# Altium schematic sheet LPDDR4.SchDoc: LPDDR4
size A2; DrawnBy: UKAYACIK; Engineer: UKAYACIK; DocumentNumber: 10; Revision: B; SheetNumber: 12; SheetTotal: 21
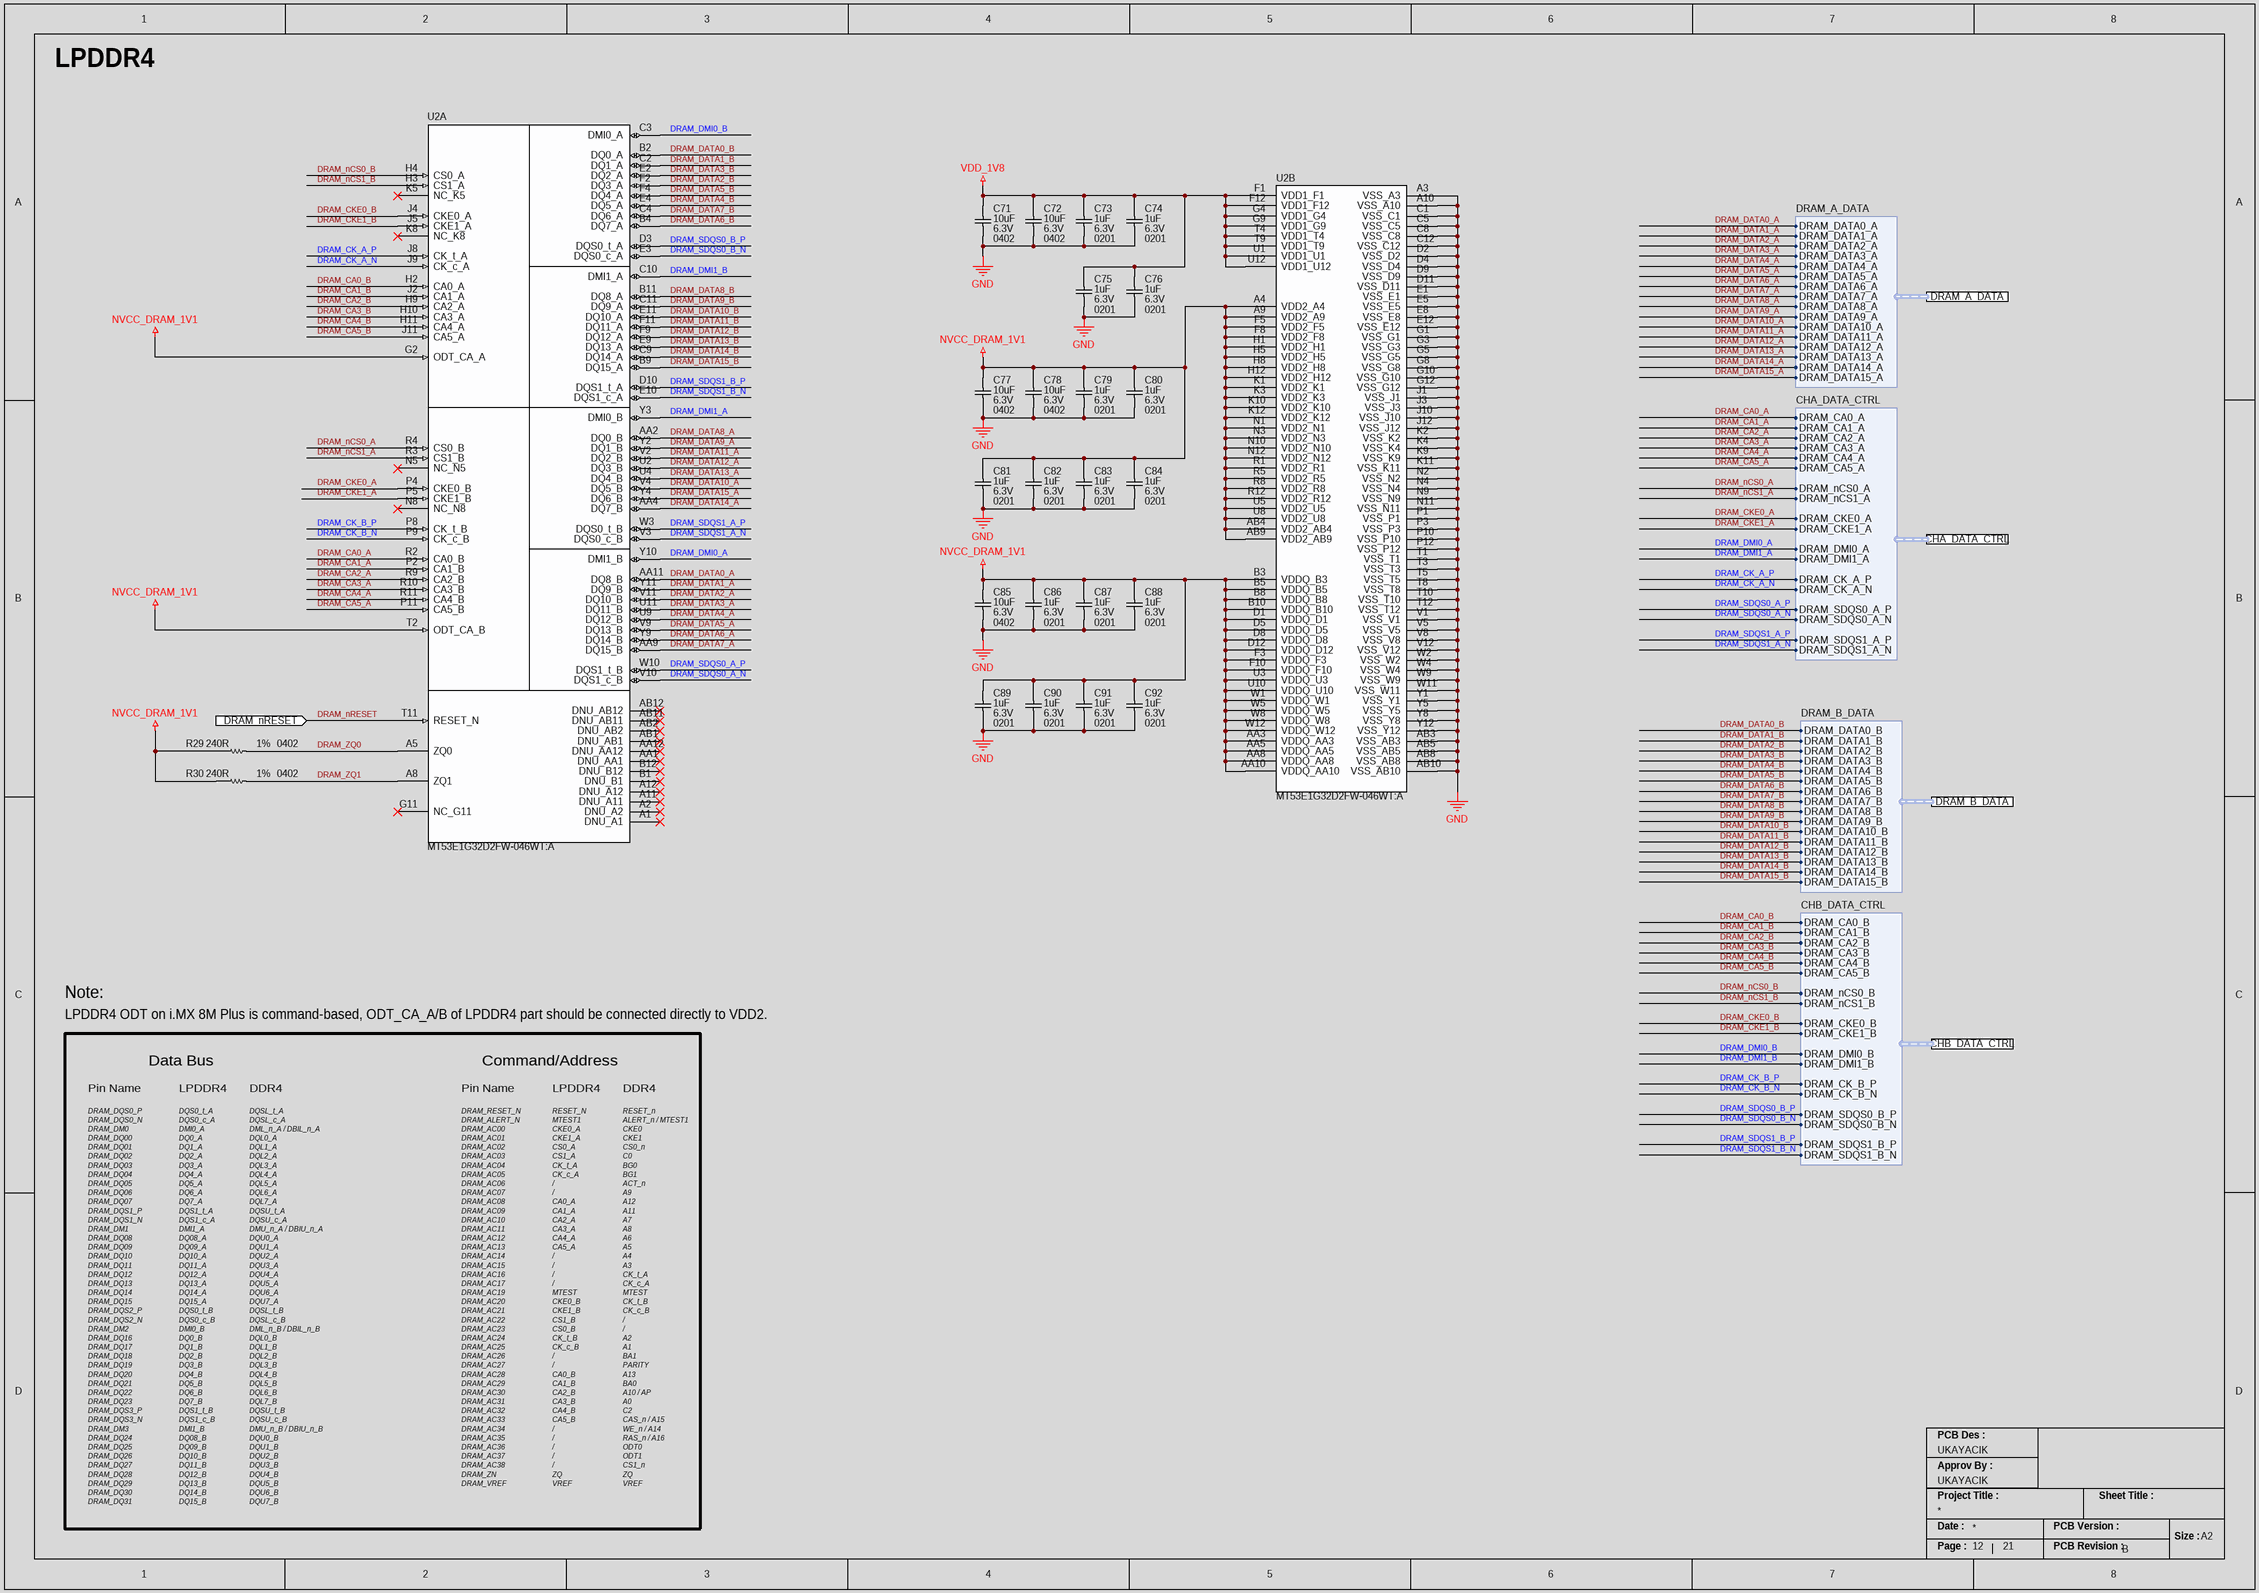
[diagram p0: LPDDR4.SchDoc]

## Parts
C71  Case/Package: 0402  Capacitance: 10uF  Voltage Rating: 6.3V  [CAP_0402_CAPC1005X05N]  (hidden comment: CL05A106MQ5NUNC)
C72  Case/Package: 0402  Capacitance: 10uF  Voltage Rating: 6.3V  [CAP_0402_CAPC1005X05N]  (hidden comment: CL05A106MQ5NUNC)
C73  Voltage Rating (DC): 6.3V  Capacitance: 1uF  Case/Package: 0201  [CAP_0201_CAPC0603X03N]  (hidden comment: 02016D105MAT2A)
C74  Voltage Rating (DC): 6.3V  Capacitance: 1uF  Case/Package: 0201  [CAP_0201_CAPC0603X03N]  (hidden comment: 02016D105MAT2A)
C75  Voltage Rating (DC): 6.3V  Capacitance: 1uF  Case/Package: 0201  [CAP_0201_CAPC0603X03N]  (hidden comment: 02016D105MAT2A)
C76  Voltage Rating (DC): 6.3V  Capacitance: 1uF  Case/Package: 0201  [CAP_0201_CAPC0603X03N]  (hidden comment: 02016D105MAT2A)
C77  Case/Package: 0402  Capacitance: 10uF  Voltage Rating: 6.3V  [CAP_0402_CAPC1005X05N]  (hidden comment: CL05A106MQ5NUNC)
C78  Case/Package: 0402  Capacitance: 10uF  Voltage Rating: 6.3V  [CAP_0402_CAPC1005X05N]  (hidden comment: CL05A106MQ5NUNC)
C79  Voltage Rating (DC): 6.3V  Capacitance: 1uF  Case/Package: 0201  [CAP_0201_CAPC0603X03N]  (hidden comment: 02016D105MAT2A)
C80  Voltage Rating (DC): 6.3V  Capacitance: 1uF  Case/Package: 0201  [CAP_0201_CAPC0603X03N]  (hidden comment: 02016D105MAT2A)
C81  Voltage Rating (DC): 6.3V  Capacitance: 1uF  Case/Package: 0201  [CAP_0201_CAPC0603X03N]  (hidden comment: 02016D105MAT2A)
C82  Voltage Rating (DC): 6.3V  Capacitance: 1uF  Case/Package: 0201  [CAP_0201_CAPC0603X03N]  (hidden comment: 02016D105MAT2A)
C83  Voltage Rating (DC): 6.3V  Capacitance: 1uF  Case/Package: 0201  [CAP_0201_CAPC0603X03N]  (hidden comment: 02016D105MAT2A)
C84  Voltage Rating (DC): 6.3V  Capacitance: 1uF  Case/Package: 0201  [CAP_0201_CAPC0603X03N]  (hidden comment: 02016D105MAT2A)
C85  Case/Package: 0402  Capacitance: 10uF  Voltage Rating: 6.3V  [CAP_0402_CAPC1005X05N]  (hidden comment: CL05A106MQ5NUNC)
C86  Voltage Rating (DC): 6.3V  Capacitance: 1uF  Case/Package: 0201  [CAP_0201_CAPC0603X03N]  (hidden comment: 02016D105MAT2A)
C87  Voltage Rating (DC): 6.3V  Capacitance: 1uF  Case/Package: 0201  [CAP_0201_CAPC0603X03N]  (hidden comment: 02016D105MAT2A)
C88  Voltage Rating (DC): 6.3V  Capacitance: 1uF  Case/Package: 0201  [CAP_0201_CAPC0603X03N]  (hidden comment: 02016D105MAT2A)
C89  Voltage Rating (DC): 6.3V  Capacitance: 1uF  Case/Package: 0201  [CAP_0201_CAPC0603X03N]  (hidden comment: 02016D105MAT2A)
C90  Voltage Rating (DC): 6.3V  Capacitance: 1uF  Case/Package: 0201  [CAP_0201_CAPC0603X03N]  (hidden comment: 02016D105MAT2A)
C91  Voltage Rating (DC): 6.3V  Capacitance: 1uF  Case/Package: 0201  [CAP_0201_CAPC0603X03N]  (hidden comment: 02016D105MAT2A)
C92  Voltage Rating (DC): 6.3V  Capacitance: 1uF  Case/Package: 0201  [CAP_0201_CAPC0603X03N]  (hidden comment: 02016D105MAT2A)
R29  Tolerance: 1%  Resistance: 240R  Case/Package: 0402  [RES_0402_RESC1005X04N]  (hidden comment: RC0402FR-07240RL)
R30  Tolerance: 1%  Resistance: 240R  Case/Package: 0402  [RES_0402_RESC1005X04N]  (hidden comment: RC0402FR-07240RL)
U2  MT53E1G32D2FW-046WT:A  [IC_DRAM_BGA200_0P65X0P8_10P1X14P6]  (parts A,B of 2)

## Ports
CHA_DATA_CTRL (harness CHA_DATA_CTRL), CHB_DATA_CTRL (harness CHB_DATA_CTRL), DRAM_A_DATA (harness DRAM_A_DATA), DRAM_B_DATA (harness DRAM_B_DATA), DRAM_nRESET (in)

## Harnesses
DRAM_A_DATA: DRAM_DATA0_A, DRAM_DATA1_A, DRAM_DATA2_A, DRAM_DATA3_A, DRAM_DATA4_A, DRAM_DATA5_A, DRAM_DATA6_A, DRAM_DATA7_A, DRAM_DATA8_A, DRAM_DATA9_A, DRAM_DATA10_A, DRAM_DATA11_A, DRAM_DATA12_A, DRAM_DATA13_A, DRAM_DATA14_A, DRAM_DATA15_A
CHA_DATA_CTRL: DRAM_CA0_A, DRAM_CA1_A, DRAM_CA2_A, DRAM_CA3_A, DRAM_CA4_A, DRAM_CA5_A, DRAM_nCS0_A, DRAM_nCS1_A, DRAM_CKE0_A, DRAM_CKE1_A, DRAM_CK_A_P, DRAM_CK_A_N, DRAM_DMI0_A, DRAM_DMI1_A, DRAM_SDQS0_A_P, DRAM_SDQS0_A_N, DRAM_SDQS1_A_P, DRAM_SDQS1_A_N
DRAM_B_DATA: DRAM_DATA0_B, DRAM_DATA1_B, DRAM_DATA2_B, DRAM_DATA3_B, DRAM_DATA4_B, DRAM_DATA5_B, DRAM_DATA6_B, DRAM_DATA7_B, DRAM_DATA8_B, DRAM_DATA9_B, DRAM_DATA10_B, DRAM_DATA11_B, DRAM_DATA12_B, DRAM_DATA13_B, DRAM_DATA14_B, DRAM_DATA15_B
CHB_DATA_CTRL: DRAM_CA0_B, DRAM_CA1_B, DRAM_CA2_B, DRAM_CA3_B, DRAM_CA4_B, DRAM_CA5_B, DRAM_nCS0_B, DRAM_nCS1_B, DRAM_CKE0_B, DRAM_CKE1_B, DRAM_CK_B_P, DRAM_CK_B_N, DRAM_DMI0_B, DRAM_DMI1_B, DRAM_SDQS0_B_P, DRAM_SDQS0_B_N, DRAM_SDQS1_B_P, DRAM_SDQS1_B_N

## Nets
GND: C71.1 C72.1 C73.1 C74.1 C75.1 C76.1 C77.1 C78.1 C79.1 C80.1 C81.1 C82.1 C83.1 C84.1 C85.1 C86.1 C87.1 C88.1 C89.1 C90.1 C91.1 C92.1 U2.A3(VSS_A3) U2.A10(VSS_A10) U2.AB3(VSS_AB3) U2.AB5(VSS_AB5) U2.AB8(VSS_AB8) U2.AB10(VSS_AB10) U2.C1(VSS_C1) U2.C5(VSS_C5) U2.C8(VSS_C8) U2.C12(VSS_C12) U2.D2(VSS_D2) U2.D4(VSS_D4) U2.D9(VSS_D9) U2.D11(VSS_D11) U2.E1(VSS_E1) U2.E5(VSS_E5) U2.E8(VSS_E8) U2.E12(VSS_E12) U2.G1(VSS_G1) U2.G3(VSS_G3) U2.G5(VSS_G5) U2.G8(VSS_G8) U2.G10(VSS_G10) U2.G12(VSS_G12) U2.J1(VSS_J1) U2.J3(VSS_J3) U2.J10(VSS_J10) U2.J12(VSS_J12) U2.K2(VSS_K2) U2.K4(VSS_K4) U2.K9(VSS_K9) U2.K11(VSS_K11) U2.N2(VSS_N2) U2.N4(VSS_N4) U2.N9(VSS_N9) U2.N11(VSS_N11) U2.P1(VSS_P1) U2.P3(VSS_P3) U2.P10(VSS_P10) U2.P12(VSS_P12) U2.T1(VSS_T1) U2.T3(VSS_T3) U2.T5(VSS_T5) U2.T8(VSS_T8) U2.T10(VSS_T10) U2.T12(VSS_T12) U2.V1(VSS_V1) U2.V5(VSS_V5) U2.V8(VSS_V8) U2.V12(VSS_V12) U2.W2(VSS_W2) U2.W4(VSS_W4) U2.W9(VSS_W9) U2.W11(VSS_W11) U2.Y1(VSS_Y1) U2.Y5(VSS_Y5) U2.Y8(VSS_Y8) U2.Y12(VSS_Y12)
NVCC_DRAM_1V1: C77.2 C78.2 C79.2 C80.2 C81.2 C82.2 C83.2 C84.2 C85.2 C86.2 C87.2 C88.2 C89.2 C90.2 C91.2 C92.2 R29.1 R30.1 U2.A4(VDD2_A4) U2.A9(VDD2_A9) U2.AA3(VDDQ_AA3) U2.AA5(VDDQ_AA5) U2.AA8(VDDQ_AA8) U2.AA10(VDDQ_AA10) U2.AB4(VDD2_AB4) U2.AB9(VDD2_AB9) U2.B3(VDDQ_B3) U2.B5(VDDQ_B5) U2.B8(VDDQ_B8) U2.B10(VDDQ_B10) U2.D1(VDDQ_D1) U2.D5(VDDQ_D5) U2.D8(VDDQ_D8) U2.D12(VDDQ_D12) U2.F3(VDDQ_F3) U2.F5(VDD2_F5) U2.F8(VDD2_F8) U2.F10(VDDQ_F10) U2.G2(ODT_CA_A) U2.H1(VDD2_H1) U2.H5(VDD2_H5) U2.H8(VDD2_H8) U2.H12(VDD2_H12) U2.K1(VDD2_K1) U2.K3(VDD2_K3) U2.K10(VDD2_K10) U2.K12(VDD2_K12) U2.N1(VDD2_N1) U2.N3(VDD2_N3) U2.N10(VDD2_N10) U2.N12(VDD2_N12) U2.R1(VDD2_R1) U2.R5(VDD2_R5) U2.R8(VDD2_R8) U2.R12(VDD2_R12) U2.T2(ODT_CA_B) U2.U3(VDDQ_U3) U2.U5(VDD2_U5) U2.U8(VDD2_U8) U2.U10(VDDQ_U10) U2.W1(VDDQ_W1) U2.W5(VDDQ_W5) U2.W8(VDDQ_W8) U2.W12(VDDQ_W12)
VDD_1V8: C71.2 C72.2 C73.2 C74.2 C75.2 C76.2 U2.F1(VDD1_F1) U2.F12(VDD1_F12) U2.G4(VDD1_G4) U2.G9(VDD1_G9) U2.T4(VDD1_T4) U2.T9(VDD1_T9) U2.U1(VDD1_U1) U2.U12(VDD1_U12)
DRAM_CA0_A: U2.R2(CA0_B) ; port CHA_DATA_CTRL.DRAM_CA0_A
DRAM_CA0_B: U2.H2(CA0_A) ; port CHB_DATA_CTRL.DRAM_CA0_B
DRAM_CA1_A: U2.P2(CA1_B) ; port CHA_DATA_CTRL.DRAM_CA1_A
DRAM_CA1_B: U2.J2(CA1_A) ; port CHB_DATA_CTRL.DRAM_CA1_B
DRAM_CA2_A: U2.R9(CA2_B) ; port CHA_DATA_CTRL.DRAM_CA2_A
DRAM_CA2_B: U2.H9(CA2_A) ; port CHB_DATA_CTRL.DRAM_CA2_B
DRAM_CA3_A: U2.R10(CA3_B) ; port CHA_DATA_CTRL.DRAM_CA3_A
DRAM_CA3_B: U2.H10(CA3_A) ; port CHB_DATA_CTRL.DRAM_CA3_B
DRAM_CA4_A: U2.R11(CA4_B) ; port CHA_DATA_CTRL.DRAM_CA4_A
DRAM_CA4_B: U2.H11(CA4_A) ; port CHB_DATA_CTRL.DRAM_CA4_B
DRAM_CA5_A: U2.P11(CA5_B) ; port CHA_DATA_CTRL.DRAM_CA5_A
DRAM_CA5_B: U2.J11(CA5_A) ; port CHB_DATA_CTRL.DRAM_CA5_B
DRAM_CK_A_N: U2.J9(CK_c_A) ; port CHA_DATA_CTRL.DRAM_CK_A_N
DRAM_CK_A_P: U2.J8(CK_t_A) ; port CHA_DATA_CTRL.DRAM_CK_A_P
DRAM_CK_B_N: U2.P9(CK_c_B) ; port CHB_DATA_CTRL.DRAM_CK_B_N
DRAM_CK_B_P: U2.P8(CK_t_B) ; port CHB_DATA_CTRL.DRAM_CK_B_P
DRAM_CKE0_A: U2.P4(CKE0_B) ; port CHA_DATA_CTRL.DRAM_CKE0_A
DRAM_CKE0_B: U2.J4(CKE0_A) ; port CHB_DATA_CTRL.DRAM_CKE0_B
DRAM_CKE1_A: U2.P5(CKE1_B) ; port CHA_DATA_CTRL.DRAM_CKE1_A
DRAM_CKE1_B: U2.J5(CKE1_A) ; port CHB_DATA_CTRL.DRAM_CKE1_B
DRAM_DATA0_A: U2.AA11(DQ8_B) ; port DRAM_A_DATA.DRAM_DATA0_A
DRAM_DATA0_B: U2.B2(DQ0_A) ; port DRAM_B_DATA.DRAM_DATA0_B
DRAM_DATA1_A: U2.Y11(DQ9_B) ; port DRAM_A_DATA.DRAM_DATA1_A
DRAM_DATA1_B: U2.C2(DQ1_A) ; port DRAM_B_DATA.DRAM_DATA1_B
DRAM_DATA2_A: U2.V11(DQ10_B) ; port DRAM_A_DATA.DRAM_DATA2_A
DRAM_DATA2_B: U2.F2(DQ3_A) ; port DRAM_B_DATA.DRAM_DATA2_B
DRAM_DATA3_A: U2.U11(DQ11_B) ; port DRAM_A_DATA.DRAM_DATA3_A
DRAM_DATA3_B: U2.E2(DQ2_A) ; port DRAM_B_DATA.DRAM_DATA3_B
DRAM_DATA4_A: U2.U9(DQ12_B) ; port DRAM_A_DATA.DRAM_DATA4_A
DRAM_DATA4_B: U2.E4(DQ5_A) ; port DRAM_B_DATA.DRAM_DATA4_B
DRAM_DATA5_A: U2.V9(DQ13_B) ; port DRAM_A_DATA.DRAM_DATA5_A
DRAM_DATA5_B: U2.F4(DQ4_A) ; port DRAM_B_DATA.DRAM_DATA5_B
DRAM_DATA6_A: U2.Y9(DQ14_B) ; port DRAM_A_DATA.DRAM_DATA6_A
DRAM_DATA6_B: U2.B4(DQ7_A) ; port DRAM_B_DATA.DRAM_DATA6_B
DRAM_DATA7_A: U2.AA9(DQ15_B) ; port DRAM_A_DATA.DRAM_DATA7_A
DRAM_DATA7_B: U2.C4(DQ6_A) ; port DRAM_B_DATA.DRAM_DATA7_B
DRAM_DATA8_A: U2.AA2(DQ0_B) ; port DRAM_A_DATA.DRAM_DATA8_A
DRAM_DATA8_B: U2.B11(DQ8_A) ; port DRAM_B_DATA.DRAM_DATA8_B
DRAM_DATA9_A: U2.Y2(DQ1_B) ; port DRAM_A_DATA.DRAM_DATA9_A
DRAM_DATA9_B: U2.C11(DQ9_A) ; port DRAM_B_DATA.DRAM_DATA9_B
DRAM_DATA10_A: U2.V4(DQ5_B) ; port DRAM_A_DATA.DRAM_DATA10_A
DRAM_DATA10_B: U2.E11(DQ10_A) ; port DRAM_B_DATA.DRAM_DATA10_B
DRAM_DATA11_A: U2.V2(DQ2_B) ; port DRAM_A_DATA.DRAM_DATA11_A
DRAM_DATA11_B: U2.F11(DQ11_A) ; port DRAM_B_DATA.DRAM_DATA11_B
DRAM_DATA12_A: U2.U2(DQ3_B) ; port DRAM_A_DATA.DRAM_DATA12_A
DRAM_DATA12_B: U2.F9(DQ12_A) ; port DRAM_B_DATA.DRAM_DATA12_B
DRAM_DATA13_A: U2.U4(DQ4_B) ; port DRAM_A_DATA.DRAM_DATA13_A
DRAM_DATA13_B: U2.E9(DQ13_A) ; port DRAM_B_DATA.DRAM_DATA13_B
DRAM_DATA14_A: U2.AA4(DQ7_B) ; port DRAM_A_DATA.DRAM_DATA14_A
DRAM_DATA14_B: U2.C9(DQ14_A) ; port DRAM_B_DATA.DRAM_DATA14_B
DRAM_DATA15_A: U2.Y4(DQ6_B) ; port DRAM_A_DATA.DRAM_DATA15_A
DRAM_DATA15_B: U2.B9(DQ15_A) ; port DRAM_B_DATA.DRAM_DATA15_B
DRAM_DMI0_A: U2.Y10(DMI1_B) ; port CHA_DATA_CTRL.DRAM_DMI0_A
DRAM_DMI0_B: U2.C3(DMI0_A) ; port CHB_DATA_CTRL.DRAM_DMI0_B
DRAM_DMI1_A: U2.Y3(DMI0_B) ; port CHA_DATA_CTRL.DRAM_DMI1_A
DRAM_DMI1_B: U2.C10(DMI1_A) ; port CHB_DATA_CTRL.DRAM_DMI1_B
DRAM_nCS0_A: U2.R4(CS0_B) ; port CHA_DATA_CTRL.DRAM_nCS0_A
DRAM_nCS0_B: U2.H4(CS0_A) ; port CHB_DATA_CTRL.DRAM_nCS0_B
DRAM_nCS1_A: U2.R3(CS1_B) ; port CHA_DATA_CTRL.DRAM_nCS1_A
DRAM_nCS1_B: U2.H3(CS1_A) ; port CHB_DATA_CTRL.DRAM_nCS1_B
DRAM_nRESET: U2.T11(RESET_N) ; port DRAM_nRESET
DRAM_SDQS0_A_N: U2.V10(DQS1_c_B) ; port CHA_DATA_CTRL.DRAM_SDQS0_A_N
DRAM_SDQS0_A_P: U2.W10(DQS1_t_B) ; port CHA_DATA_CTRL.DRAM_SDQS0_A_P
DRAM_SDQS0_B_N: U2.E3(DQS0_c_A) ; port CHB_DATA_CTRL.DRAM_SDQS0_B_N
DRAM_SDQS0_B_P: U2.D3(DQS0_t_A) ; port CHB_DATA_CTRL.DRAM_SDQS0_B_P
DRAM_SDQS1_A_N: U2.V3(DQS0_c_B) ; port CHA_DATA_CTRL.DRAM_SDQS1_A_N
DRAM_SDQS1_A_P: U2.W3(DQS0_t_B) ; port CHA_DATA_CTRL.DRAM_SDQS1_A_P
DRAM_SDQS1_B_N: U2.E10(DQS1_c_A) ; port CHB_DATA_CTRL.DRAM_SDQS1_B_N
DRAM_SDQS1_B_P: U2.D10(DQS1_t_A) ; port CHB_DATA_CTRL.DRAM_SDQS1_B_P
DRAM_ZQ0: R29.2 U2.A5(ZQ0)
DRAM_ZQ1: R30.2 U2.A8(ZQ1)

Not connected (* = marked no-connect by the designer): U2 A1(DNU_A1)* A2(DNU_A2)* A11(DNU_A11)* A12(DNU_A12)* AA1(DNU_AA1)* AA12(DNU_AA12)* AB1(DNU_AB1)* AB2(DNU_AB2)* AB11(DNU_AB11)* AB12(DNU_AB12)* B1(DNU_B1)* B12(DNU_B12)* G11(NC_G11)* K5(NC_K5)* K8(NC_K8)* N5(NC_N5)* N8(NC_N8)*

## Notes on the sheet
- LPDDR4
- Note:
- LPDDR4 ODT on i.MX 8M Plus is command-based, ODT_CA_A/B of LPDDR4 part should be connected directly to VDD2.
- Pin Name
- Data Bus
- DDR4
- Command/Address
- DRAM_DQS0_P
  DRAM_DQS0_N
  DRAM_DM0
  DRAM_DQ00
  DRAM_DQ01
  DRAM_DQ02
  DRAM_DQ03
  DRAM_DQ04
  DRAM_DQ05
  DRAM_DQ06
  DRAM_DQ07
  DRAM_DQS1_P
  DRAM_DQS1_N
  DRAM_DM1
  DRAM_DQ08
  DRAM_DQ09
  DRAM_DQ10
  DRAM_DQ11
  DRAM_DQ12
  DRAM_DQ13
  DRAM_DQ14
  DRAM_DQ15
  DRAM_DQS2_P
  DRAM_DQS2_N
  DRAM_DM2
  DRAM_DQ16
  DRAM_DQ17
  DRAM_DQ18
  DRAM_DQ19
  DRAM_DQ20
  DRAM_DQ21
  DRAM_DQ22
  DRAM_DQ23
  DRAM_DQS3_P
  DRAM_DQS3_N
  DRAM_DM3
  DRAM_DQ24
  DRAM_DQ25
  DRAM_DQ26
  DRAM_DQ27
  DRAM_DQ28
  DRAM_DQ29
  DRAM_DQ30
  DRAM_DQ31
- DQS0_t_A
  DQS0_c_A
  DMI0_A
  DQ0_A
  DQ1_A
  DQ2_A
  DQ3_A
  DQ4_A
  DQ5_A
  DQ6_A
  DQ7_A
  DQS1_t_A
  DQS1_c_A
  DMI1_A
  DQ08_A
  DQ09_A
  DQ10_A
  DQ11_A
  DQ12_A
  DQ13_A
  DQ14_A
  DQ15_A
  DQS0_t_B
  DQS0_c_B
  DMI0_B
  DQ0_B
  DQ1_B
  DQ2_B
  DQ3_B
  DQ4_B
  DQ5_B
  DQ6_B
  DQ7_B
  DQS1_t_B
  DQS1_c_B
  DMI1_B
  DQ08_B
  DQ09_B
  DQ10_B
  DQ11_B
  DQ12_B
  DQ13_B
  DQ14_B
  DQ15_B
- DQSL_t_A
  DQSL_c_A
  DML_n_A / DBIL_n_A
  DQL0_A
  DQL1_A
  DQL2_A
  DQL3_A
  DQL4_A
  DQL5_A
  DQL6_A
  DQL7_A
  DQSU_t_A
  DQSU_c_A
  DMU_n_A / DBIU_n_A
  DQU0_A
  DQU1_A
  DQU2_A
  DQU3_A
  DQU4_A
  DQU5_A
  DQU6_A
  DQU7_A
  DQSL_t_B
  DQSL_c_B
  DML_n_B / DBIL_n_B
  DQL0_B
  DQL1_B
  DQL2_B
  DQL3_B
  DQL4_B
  DQL5_B
  DQL6_B
  DQL7_B
  DQSU_t_B
  DQSU_c_B
  DMU_n_B / DBIU_n_B
  DQU0_B
  DQU1_B
  DQU2_B
  DQU3_B
  DQU4_B
  DQU5_B
  DQU6_B
  DQU7_B
- DRAM_RESET_N
  DRAM_ALERT_N
  DRAM_AC00
  DRAM_AC01
  DRAM_AC02
  DRAM_AC03
  DRAM_AC04
  DRAM_AC05
  DRAM_AC06
  DRAM_AC07
  DRAM_AC08
  DRAM_AC09
  DRAM_AC10
  DRAM_AC11
  DRAM_AC12
  DRAM_AC13
  DRAM_AC14
  DRAM_AC15
  DRAM_AC16
  DRAM_AC17
  DRAM_AC19
  DRAM_AC20
  DRAM_AC21
  DRAM_AC22
  DRAM_AC23
  DRAM_AC24
  DRAM_AC25
  DRAM_AC26
  DRAM_AC27
  DRAM_AC28
  DRAM_AC29
  DRAM_AC30
  DRAM_AC31
  DRAM_AC32
  DRAM_AC33
  DRAM_AC34
  DRAM_AC35
  DRAM_AC36
  DRAM_AC37
  DRAM_AC38
  DRAM_ZN
  DRAM_VREF
- RESET_N
  MTEST1
  CKE0_A
  CKE1_A
  CS0_A
  CS1_A
  CK_t_A
  CK_c_A
  /
  /
  CA0_A
  CA1_A
  CA2_A
  CA3_A
  CA4_A
  CA5_A
  /
  /
  /
  /
  MTEST
  CKE0_B
  CKE1_B
  CS1_B
  CS0_B
  CK_t_B
  CK_c_B
  /
  /
  CA0_B
  CA1_B
  CA2_B
  CA3_B
  CA4_B
  CA5_B
  /
  /
  /
  /
  /
  ZQ
  VREF
- RESET_n
  ALERT_n / MTEST1
  CKE0
  CKE1
  CS0_n
  C0
  BG0
  BG1
  ACT_n
  A9
  A12
  A11
  A7
  A8
  A6
  A5
  A4
  A3
  CK_t_A
  CK_c_A
  MTEST
  CK_t_B
  CK_c_B
  /
  /
  A2
  A1
  BA1
  PARITY
  A13
  BA0
  A10 / AP
  A0
  C2
  CAS_n / A15
  WE_n / A14
  RAS_n / A16
  ODT0
  ODT1
  CS1_n
  ZQ
  VREF
- PCB Des :
- Approv By :
- Project Title :
- Sheet Title :
- Date :
- Page :
- PCB Version :
- PCB Revision :
- Size :
- A2

## Library data of the parts
C71 C72 C77 C78 C85 = CAP_10UF_6.3V_X5R_0402: Cap Ceramic 10uF 6.3V X5R 20% SMD 0402 85C T/R; Manufacturer: Samsung; Supplier 1: Digikey; Manufacturer Part Number: CL05A106MQ5NUNC; RoHS: Yes; Category: Ceramic Capacitors; Stock 1: 6097180; Pricing 1: 1=0.24, 10=0.153, 50=0.0968, 100=0.0774, 500=0.05588, 1000=0.04943, 2500=0.04728, 5000=0.04299 (USD); Mount: Surface Mount; Case Code (Metric): 1005; Case Code (Imperial): 0402; Min Operating Temperature: -55°C; Max Operating Temperature: 85°C; Packaging: Tape and Reel; Tolerance: 20%; Dielectric: X5R; Series: CL; Package Quantity: 1; Construction: Flat; Length: 1mm; Width: 0.02inch; Height: 0.5mm; Depth: 0.5mm; Thickness: 0.028inch; Radiation Hardening: No; RoHS Compliant: Yes; ComponentLink1URL: https://datasheet.ciiva.com/16437/cl05a106mq5nunc-16437356.pdf?src-supplier=Future+Electronics; ComponentLink1Description: https://datasheet.ciiva.com/16437/cl05a106mq5nunc-16437356.pdf?src-supplier=Future+Electronics; ComponentLink2URL: https://datasheet.ciiva.com/26877/getdatasheetpartid-355289-26877841.pdf?src-supplier=Verical; ComponentLink2Description: https://datasheet.ciiva.com/26877/getdatasheetpartid-355289-26877841.pdf?src-supplier=Verical; Supplier Part Number 1: 1276-1451-1-ND
C73-C76 C79-C84 C86-C92 = CAP_1UF_6.3V_X5R_0201: 0201 1 uF 6.3 V ±20 % Tolerance X5R Surface Mount Multilayer Ceramic Capacitor; Manufacturer: Kyocera AVX; Tolerance: 20%; Supplier 1: Mouser; Manufacturer Part Number: 02016D105MAT2A; RoHS: Yes; Category: Ceramic Capacitors; Stock 1: 1026413; Pricing 1: 1=0.1, 10=0.028, 50=0.028, 100=0.014, 1000=0.008, 10000=0.006 (USD); Mount: Surface Mount; Number of Pins: 2; Case Code (Metric): 0603; Case Code (Imperial): 0201; Min Operating Temperature: -55°C; Max Operating Temperature: 85°C; Packaging: Cut Tape; Series: -; Voltage Rating: 6.3V; Package Quantity: 1; Length: 0.024inch; Width: 0.012inch; Thickness: 0.013inch; Depth: 0.3mm; Lead Free: Lead Free; RoHS Compliant: Yes; Reach SVHC Compliant: No; ComponentLink1URL: https://datasheet.ciiva.com/6265/cx5r-6265595.pdf?src-supplier=Digi-Key; ComponentLink1Description: https://datasheet.ciiva.com/6265/cx5r-6265595.pdf?src-supplier=Digi-Key; ComponentLink2URL: https://datasheet.ciiva.com/1123/1666675-1123122.pdf?src-supplier=Element14; ComponentLink2Description: https://datasheet.ciiva.com/1123/1666675-1123122.pdf?src-supplier=Element14; ComponentLink3URL: https://datasheet.ciiva.com/14891/cx5r-14891029.pdf?src-supplier=Digi-Key; ComponentLink3Description: https://datasheet.ciiva.com/14891/cx5r-14891029.pdf?src-supplier=Digi-Key; ComponentLink4URL: https://datasheet.ciiva.com/7614/cx5r-7614682.pdf?src-supplier=Digi-Key; ComponentLink4Description: https://datasheet.ciiva.com/7614/cx5r-7614682.pdf?src-supplier=Digi-Key; ComponentLink5URL: https://datasheet.ciiva.com/14891/cx5r-14891030.pdf?src-supplier=Digi-Key; ComponentLink5Description: https://datasheet.ciiva.com/14891/cx5r-14891030.pdf?src-supplier=Digi-Key; Supplier Part Number 1: 581-02016D105MAT2A; Dielectric: X5R
R29 R30 = RES_240R_1%_63mW_0402: SMD Chip Resistor, 240 Ohm, ± 1%, 63 mW, 0402 [1005 Metric], Thick Film, General Purpose; Manufacturer: Yageo; Power Rating: 63mW; Voltage Rating: 50V; Temperature Coefficient: 100ppm/°C; Supplier 1: Digi-Key; Manufacturer Part Number: RC0402FR-07240RL; RoHS: Yes; Category: Chip SMD Resistors; Stock 1: 1880273; Pricing 1: 1=0.1, 10=0.014, 50=0.0084, 100=0.007, 500=0.00464, 1000=0.00396, 5000=0.00282 (USD); Case Code (Metric): 1005; Case Code (Imperial): 0402; Size Code: 0402; Min Operating Temperature: -55°C; Max Operating Temperature: 155°C; Resistor Type: Thick Film; Packaging: Tape and Reel; Number of Terminations: 2; Termination: SMD/SMT; Max Power Dissipation: 63mW; Voltage Rating (DC): 50V; Features: Moisture Resistant; Series: RC; Construction: Rectangular; Resistance Tolerance: 1%; Length: 1mm; Depth: 0.5mm; RoHS Compliant: Yes; Military Standard: Not; Lead Free: Lead Free; Reach SVHC Compliant: Unknown; ComponentLink1URL: https://datasheet.ciiva.com/7849/1018594-7849915.pdf?src-supplier=Element14; ComponentLink1Description: https://datasheet.ciiva.com/7849/1018594-7849915.pdf?src-supplier=Element14; ComponentLink2URL: https://datasheet.ciiva.com/7849/1018594-7849916.pdf?src-supplier=Element14; ComponentLink2Description: https://datasheet.ciiva.com/7849/1018594-7849916.pdf?src-supplier=Element14; ComponentLink3URL: https://datasheet.ciiva.com/2519/pyu-r-int-thick-7-2519158.pdf?src-supplier=Digi-Key; ComponentLink3Description: https://datasheet.ciiva.com/2519/pyu-r-int-thick-7-2519158.pdf?src-supplier=Digi-Key; ComponentLink4URL: https://datasheet.ciiva.com/2519/pyu-r-int-thick-7-2519157.pdf?src-supplier=Digi-Key; ComponentLink4Description: https://datasheet.ciiva.com/2519/pyu-r-int-thick-7-2519157.pdf?src-supplier=Digi-Key; ComponentLink5URL: https://datasheet.ciiva.com/2519/pyu-r-int-thick-7-2519156.pdf?src-supplier=Digi-Key; ComponentLink5Description: https://datasheet.ciiva.com/2519/pyu-r-int-thick-7-2519156.pdf?src-supplier=Digi-Key; ComponentLink6URL: https://datasheet.ciiva.com/12669/pyu-rc0402-51-rohs-l-6-r-12669689.pdf?src-supplier=Mouser; ComponentLink6Description: https://datasheet.ciiva.com/12669/pyu-rc0402-51-rohs-l-6-r-12669689.pdf?src-supplier=Mouser; ComponentLink7URL: https://datasheet.ciiva.com/17419/pyu-rc0402-51-rohs-l-6-r-17419482.pdf?src-supplier=Future+Electronics; ComponentLink7Description: https://datasheet.ciiva.com/17419/pyu-rc0402-51-rohs-l-6-r-17419482.pdf?src-supplier=Future+Electronics; Supplier Part Number 1: 311-240LRCT-ND
U2 = IC_DRAM_32G_MT53E1G32D2FW-046WT:A: LPDDR4 32G 1GX32 FBGA DDP; Manufacturer: Micron Technology; Supplier 1: Digikey; Manufacturer Part Number: MT53E1G32D2FW-046WT:A; RoHS: No; Stock 1: 1349; Pricing 1: 1=26.73, 10=24.892, 25=24.6252, 50=24.0178, 100=21.0842, 250=20.37296, 500=19.82474 (USD); Supplier Part Number 1: 557-MT53E1G32D2FW-046WT:A-ND